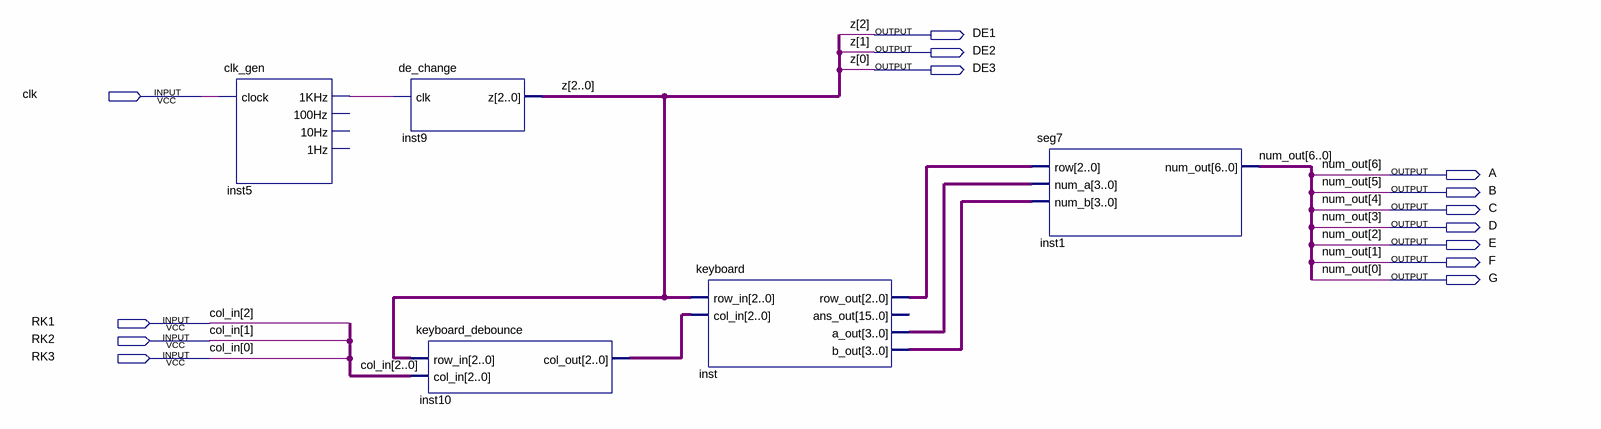
[diagram p0: schematic sheet]
// Quartus schematic key_input.bdf as structural Verilog: 5 symbols, 14 pins
module key_input (
  input  clk,
  input  RK1,
  input  RK2,
  input  RK3,
  output DE1,
  output DE2,
  output DE3,
  output A,
  output B,
  output C,
  output D,
  output E,
  output F,
  output G
);

  wire inst5_1khz;
  wire [2:0] inst10_col_out, inst_row_out;
  wire [3:0] inst_a_out, inst_b_out;

  clk_gen inst5 (.clock(clk), .\1KHz (inst5_1khz));  // open: 100Hz, 10Hz, 1Hz
  de_change inst9 (.clk(inst5_1khz), .z({DE1, DE2, DE3}));
  keyboard_debounce inst10 (.row_in({DE1, DE2, DE3}), .col_in({RK1, RK2, RK3}), .col_out(inst10_col_out));
  keyboard inst (
    .row_in({DE1, DE2, DE3}), .col_in(inst10_col_out), .row_out(inst_row_out), .a_out(inst_a_out),
    .b_out(inst_b_out));  // open: ans_out
  seg7 inst1 (.row(inst_row_out), .num_a(inst_a_out), .num_b(inst_b_out), .num_out({A, B, C, D, E, F, G}));

  // Other names for the same wires on the sheet: col_in[2:0] = {RK1, RK2, RK3}; num_out[6:0] = {A, B, C, D, E, F, G};
  //   z[2:0] = {DE1, DE2, DE3}
endmodule
